# EAGLE design untitled (EAGLE 7.2.0)
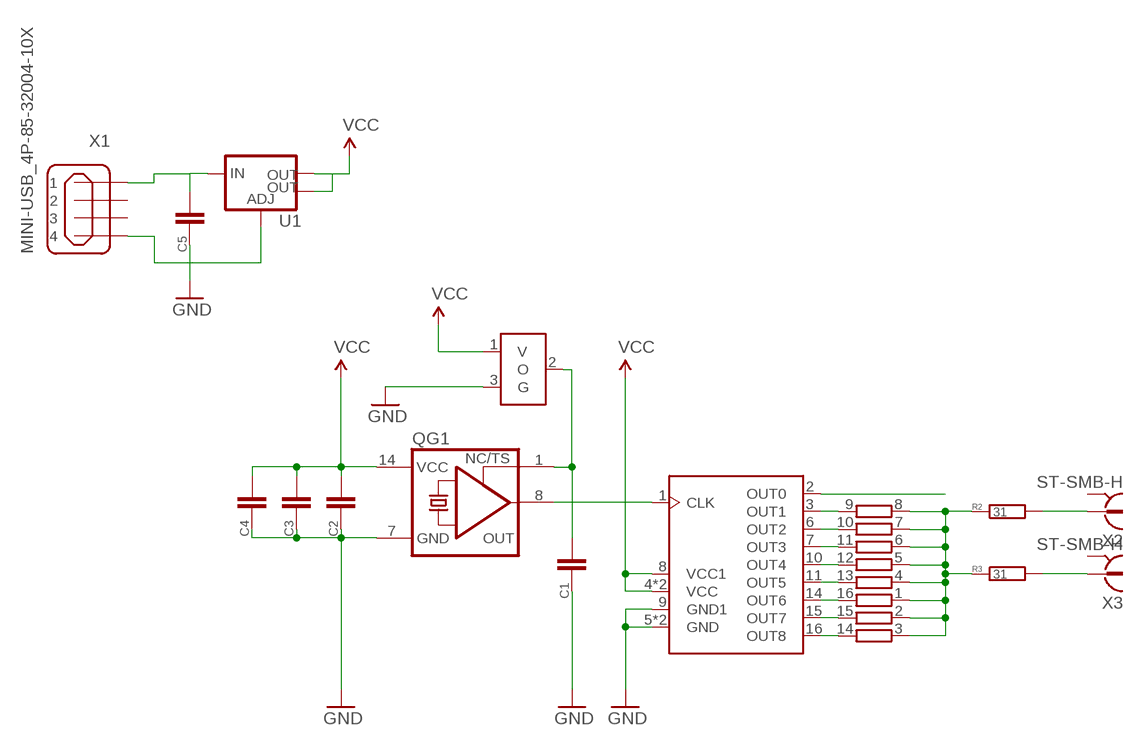
[diagram p0: schematic, sheet 1]

## Parts
C1  CC0805  [C0805]
C2  CC0805  [C0805]
C3  CC0805  [C0805]
C4  CC0805  [C0805]
C5  CC0805  [C0805]
QG1  XO-14  [DIL14S]
R1  4816P-T01  [4816P]
R2  31  R0805  [R0805]
R3  31  R0805  [R0805]
U1  V_REG_LM1117SOT223  [SOT223]
U$2  CY2309NZ  [SOIC127P600X175-16N]
U$3  REF3025  [SOT23]
X1  MINI-USB_4P-85-32004-10X  [85-32004-10X]
X2  ST-SMB-H  [ST-SMB-H]
X3  ST-SMB-H  [ST-SMB-H]

## Nets
GND: C1.2 C2.2 C3.2 C4.2 C5.2 QG1.7(GND) U1.1(ADJ) U$2.5(GND) U$2.9(GND1) U$2.12(GND) U$3.3(G) X1.4
N$1: QG1.8(OUT) U$2.1(CLK)
N$2: R1.9 U$2.3(OUT1)
N$3: R1.10 U$2.6(OUT2)
N$4: R1.11 U$2.7(OUT3)
N$5: R1.12 U$2.10(OUT4)
N$6: R1.1 R1.2 R1.3 R1.4 R1.5 R1.6 R1.7 R1.8 R2.1 R3.1
N$7: R1.13 U$2.11(OUT5)
N$8: R1.16 U$2.14(OUT6)
N$9: R1.15 U$2.15(OUT7)
N$10: R1.14 U$2.16(OUT8)
N$11: R2.2 X2.1
N$12: R3.2 X3.1
N$15: U$2.2(OUT0)
N$16: C1.1 QG1.1(TS) U$3.2(O)
N$19: C5.1 U1.3(IN) X1.1
VCC: C2.1 C3.1 C4.1 QG1.14(VCC) U1.2(OUT) U1.4(OUT) U$2.4(VCC) U$2.8(VCC1) U$2.13(VCC) U$3.1(V)
Unconnected: X1.2 X1.3 X2.2 X2.3 X2.4 X2.5 X3.2 X3.3 X3.4 X3.5

## Library data of the parts
C1-C5 = smalsmd:C: Capacitor
QG1 = crystal:XO-: CRYSTAL; OC_FARNELL: unknown; OC_NEWARK: unknown
R1 = resistor-bourns:4816P-T01: BOURNS RESISTOR NETWORK; MF: BOURNS, INC.; MPN: 4816P-T01-684LF; OC_FARNELL: 9357483; OC_NEWARK: 33K0707
R2 R3 = smalsmd:R
U1 = SparkFun-PowerIC:V_REG_LM1117: Voltage Regulator LM1117 Standard adjustable voltage regulator but in SMD form. Spark Fun Electronics SKU : COM-00595; PROD_ID: VREG-08170
U$2 = cypress:CY2309NZ
U$3 = ADC:REF3025
X1 = con-cypressindustries:MINI-USB_4P-: MINI USB 4 Pol. Source: www.cypressindustries.com; OC_FARNELL: unknown; OC_NEWARK: unknown
X2 X3 = con-coax:ST-SMB-H: MALE SMB CONNECTOR Radiall distributor RS 193-8861887; OC_FARNELL: unknown; OC_NEWARK: unknown

## Board
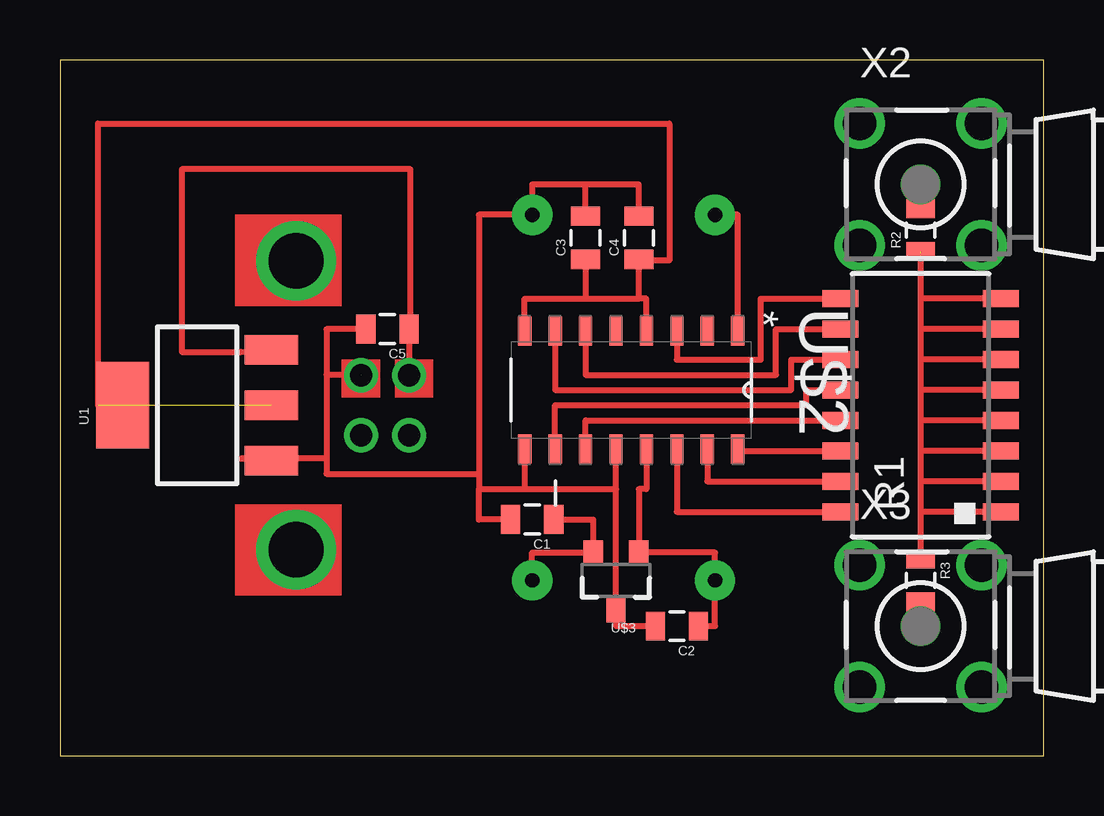
[diagram p1: board, top side]
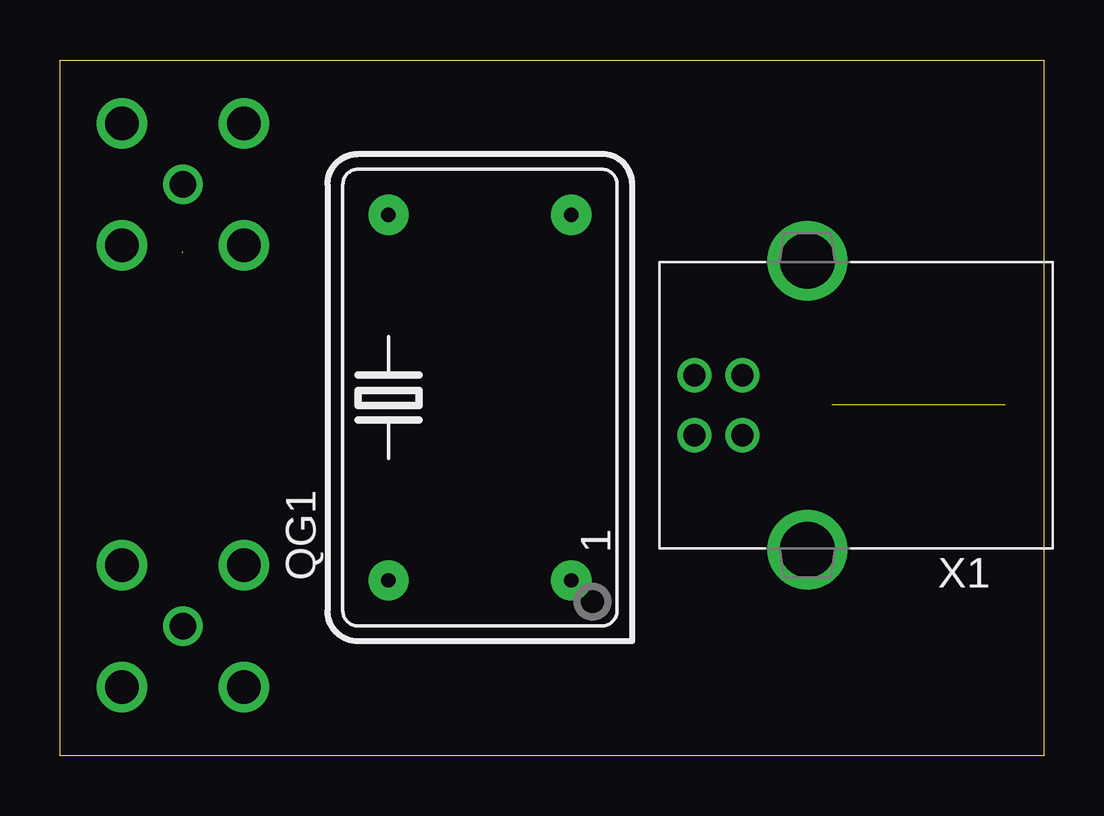
[diagram p2: board, bottom side, seen from below]

Size 41 x 29 mm. Coordinates in mm from the lower left corner, seen from the top.
Outline: 0,0 41,0 41,29 0,29 0,0
Copper layers (1*16): Top 0.035mm / dielectric 1.5mm / Bottom 0.035mm
Design rules "default": minimum track width 0.2mm, minimum drill 0.2mm, track to track 0.2mm, track to pad 0.2mm, pad to pad 0.2mm, via to via 0.2mm, smd to smd 0.2mm, copper to edge 0.2mm, drill to drill 0.2mm, minimum pad ring 10mil, minimum via ring 8mil, stop-mask expansion 4mil, vias tented up to drill 0mil, thermal gap 10mil

### Footprints (pad centres in the part's own frame; a part is rotated, then mirrored left to right if it is on the bottom)
C0805 = smd 0.8 x 1.2: 1 -0.9,0; 2 0.9,0
DIL14S = drill 0.6 pad 1.676: 1 -7.62,-3.81; 7 7.62,-3.81; 8 7.62,3.81; 14 -7.62,3.81
4816P = smd 0.7 x 1.5: 1 -4.445,-3.346; 2 -3.175,-3.346; 3 -1.905,-3.346; 4 -0.635,-3.346; 5 0.635,-3.346; 6 1.905,-3.346; 7 3.175,-3.346; 8 4.445,-3.346; 9 4.445,3.346; 10 3.175,3.346; 11 1.905,3.346; 12 0.635,3.346; 13 -0.635,3.346; 14 -1.905,3.346; 15 -3.175,3.346; 16 -4.445,3.346
R0805 = smd 0.8 x 1.2: 1 -0.9,0; 2 0.9,0
SOT223 = smd 1.219 x 2.235: 1 -2.311,-3.099; 2 0,-3.099; 3 2.311,-3.099 | smd 3.6 x 2.2: 4 0,3.099
SOIC127P600X175-16N = smd 1.2 x 0.559: 1 -2.464,4.445; 2 -2.464,3.175; 3 -2.464,1.905; 4 -2.464,0.635; 5 -2.464,-0.635; 6 -2.464,-1.905; 7 -2.464,-3.175; 8 -2.464,-4.445; 9 2.464,-4.445; 10 2.464,-3.175; 11 2.464,-1.905; 12 2.464,-0.635; 13 2.464,0.635; 14 2.464,1.905; 15 2.464,3.175; 16 2.464,4.445
SOT23 = smd 0.8 x 1: 1 -0.95,-1.159; 2 0.95,-1.159; 3 0,1.259
85-32004-10X = drill 0.92 pad 1.27: 1 4.71,-1.25; 2 4.71,1.25; 3 2.71,1.25; 4 2.71,-1.25 | drill 2.3 pad 3: M1 0,6.02; M2 0,-6.02
ST-SMB-H = drill 1.1: 1 0,0 | drill 1.4: 2 -2.54,2.54; 3 2.54,2.54; 4 2.54,-2.54; 5 -2.54,-2.54

### Placement (x,y rotation side)
C1  19.68,9.84 180 top
C2  25.72,5.4 180 top
C3  21.91,21.59 90 top
C4  24.13,21.59 90 top
C5  13.65,17.78 180 top
QG1  23.5,14.92 90 bottom
R1  35.88,14.61 90 top
R2  35.88,21.91 90 top
R3  35.88,7.3 270 top
U1  5.71,14.61 90 top
U$2  23.81,15.24 270 top
U$3  23.18,7.3 180 top
X1  9.84,14.61 180 bottom
X2  35.88,23.81 0 top
X3  35.88,5.4 0 top

### Tracks (layer width: path | path; a pad name or v marks a point on that pad's centre or on a via)
GND  (1 unrouted)
  Top 0.254: U$2.9 19.37,11.11 | 19.37,11.11 23.18,11.11 | 23.18,11.11 U$2.12 | 17.46,11.75 17.46,22.54 QG1.7 19.68,23.81 21.91,23.81 | 17.46,11.75 17.46,11.11 | 17.46,11.11 19.37,11.11 | 23.18,11.11 U$3.3 23.18,5.4 C2.2 | C1.2 17.46,9.84 17.46,11.11 | C4.2 24.13,23.81 21.91,23.81 | C3.2 21.91,23.81 | 11.11,15.88 11.11,12.38 | 11.11,12.38 7.54,12.38 U1.1 | C5.2 11.11,17.78 11.11,15.88 | 11.11,12.38 11.11,11.75 17.46,11.75 | 12.55,15.88 11.11,15.88
N$1
  Top 0.254: U$2.1 28.26,22.54 QG1.8
N$2
  Top 0.254: U$2.3 25.72,16.51 29.21,16.51 29.21,19.05 R1.9
N$3
  Top 0.254: U$2.6 21.91,15.88 29.84,15.88 29.84,17.78 R1.10
N$4
  Top 0.254: U$2.7 20.64,15.24 30.48,15.24 30.48,16.51 R1.11
N$5
  Top 0.254: U$2.10 20.64,14.61 31.11,14.61 31.11,15.24 R1.12
N$6  (1 unrouted)
  Top 0.254: R1.1 35.88,10.16 | 35.88,10.16 35.88,11.43 | 35.88,11.43 35.88,12.7 | 35.88,12.7 35.88,13.97 | 35.88,13.97 35.88,15.24 | 35.88,15.24 35.88,16.51 | 35.88,16.51 35.88,17.78 | 35.88,17.78 35.88,19.05 | 35.88,19.05 35.88,20.95 | R1.8 35.88,19.05 | R1.7 35.88,17.78 | R1.6 35.88,16.51 | R1.5 35.88,15.24 | R1.4 35.88,13.97 | R1.3 35.88,12.7 | R1.2 35.88,11.43 | R3.1 35.88,10.16
N$7
  Top 0.254: U$2.11 21.91,13.97 R1.13
N$8
  Top 0.254: U$2.14 25.72,10.16 R1.16
N$9
  Top 0.254: U$2.15 26.99,11.43 R1.15
N$10
  Top 0.254: U$2.16 28.26,12.7 R1.14
N$11
  Top 0.254: R2.2 X2.1
N$12
  Top 0.254: X3.1 R3.2
N$16
  Top 0.254: QG1.1 19.68,8.46 U$3.2 | U$3.2 | C1.1 22.23,9.84 U$3.2
N$19
  Top 0.254: X1.1 C5.1 14.61,17.78 14.61,24.45 5.08,24.45 5.08,16.83 7.54,16.83 U1.3
VCC  (1 unrouted)
  Top 0.254: U$2.4 24.45,19.05 24.13,19.05 | U$2.8 19.37,19.05 21.91,19.05 | 21.91,19.05 24.13,19.05 | U$2.13 24.45,11.11 24.13,11.11 U$3.1 27.3,8.46 QG1.14 27.3,5.4 C2.1 | 24.13,19.05 C4.1 24.77,20.64 25.4,20.64 25.4,26.35 1.59,26.35 1.59,14.61 U1.4 | C3.1 21.91,19.05
(copper drawn outside any net)
  shapes: Top area x5